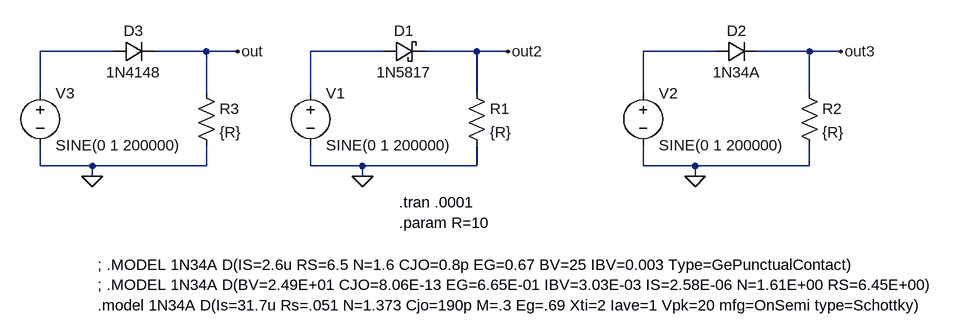
[diagram p0: schematic Diodes-Tests1.asc]
Diodes-Tests1.asc, the LTspice schematic file:
Version 4
SHEET 1 1184 680
WIRE -320 96 -432 96
WIRE -176 96 -256 96
WIRE -128 96 -176 96
WIRE 96 96 -16 96
WIRE 240 96 160 96
WIRE 288 96 240 96
WIRE 608 96 496 96
WIRE 752 96 672 96
WIRE 800 96 752 96
WIRE -432 160 -432 96
WIRE -176 160 -176 96
WIRE -16 160 -16 96
WIRE 240 160 240 96
WIRE 496 160 496 96
WIRE 752 160 752 96
WIRE -432 272 -432 240
WIRE -352 272 -432 272
WIRE -176 272 -176 240
WIRE -176 272 -352 272
WIRE -16 272 -16 240
WIRE 64 272 -16 272
WIRE 240 272 240 240
WIRE 240 272 64 272
WIRE 496 272 496 240
WIRE 576 272 496 272
WIRE 752 272 752 240
WIRE 752 272 576 272
WIRE -352 288 -352 272
WIRE 64 288 64 272
WIRE 576 288 576 272
FLAG 64 288 0
FLAG 288 96 out2
FLAG 576 288 0
FLAG 800 96 out3
FLAG -352 288 0
FLAG -128 96 out
SYMBOL voltage -16 144 R0
WINDOW 123 0 0 Left 0
WINDOW 39 0 0 Left 0
SYMATTR InstName V1
SYMATTR Value SINE(0 1 200000)
SYMBOL schottky 96 112 R270
WINDOW 0 32 32 VTop 2
WINDOW 3 0 32 VBottom 2
SYMATTR InstName D1
SYMATTR Value 1N5817
SYMATTR Description Diode
SYMATTR Type diode
SYMBOL res 224 144 R0
SYMATTR InstName R1
SYMATTR Value {R}
SYMBOL voltage 496 144 R0
WINDOW 123 0 0 Left 0
WINDOW 39 0 0 Left 0
SYMATTR InstName V2
SYMATTR Value SINE(0 1 200000)
SYMBOL res 736 144 R0
SYMATTR InstName R2
SYMATTR Value {R}
SYMBOL voltage -432 144 R0
WINDOW 123 0 0 Left 0
WINDOW 39 0 0 Left 0
SYMATTR InstName V3
SYMATTR Value SINE(0 1 200000)
SYMBOL diode -320 112 R270
WINDOW 0 32 32 VTop 2
WINDOW 3 0 32 VBottom 2
SYMATTR InstName D3
SYMATTR Value 1N4148
SYMBOL res -192 144 R0
SYMATTR InstName R3
SYMATTR Value {R}
SYMBOL diode 608 112 R270
WINDOW 0 32 32 VTop 2
WINDOW 3 0 32 VBottom 2
SYMATTR InstName D2
SYMATTR Value 1N34A
SYMATTR SpiceModel 1N34A
TEXT 120 328 Left 2 !.tran .0001\n.param R=10
TEXT -344 424 Left 2 !; .MODEL 1N34A D(IS=2.6u RS=6.5 N=1.6 CJO=0.8p EG=0.67 BV=25 IBV=0.003 Type=GePunctualContact)\n; .MODEL 1N34A D(BV=2.49E+01 CJO=8.06E-13 EG=6.65E-01 IBV=3.03E-03 IS=2.58E-06 N=1.61E+00 RS=6.45E+00)\n.model 1N34A D(Is=31.7u Rs=.051 N=1.373 Cjo=190p M=.3 Eg=.69 Xti=2 Iave=1 Vpk=20 mfg=OnSemi type=Schottky)

The netlist it stands for:
* Diodes-Tests1.asc
V1 N002 0 SINE(0 1 200000)
D1 N002 out2 1N5817
R1 out2 0 {R}
V2 N003 0 SINE(0 1 200000)
R2 out3 0 {R}
V3 N001 0 SINE(0 1 200000)
D3 N001 out 1N4148
R3 out 0 {R}
D2 N003 out3 1N34A 1N34A
.model D D
.lib standard.dio
.tran .0001
.param R=10
; .MODEL 1N34A D(IS=2.6u RS=6.5 N=1.6 CJO=0.8p EG=0.67 BV=25 IBV=0.003 Type=GePunctualContact)
; .MODEL 1N34A D(BV=2.49E+01 CJO=8.06E-13 EG=6.65E-01 IBV=3.03E-03 IS=2.58E-06 N=1.61E+00 RS=6.45E+00)
.model 1N34A D(Is=31.7u Rs=.051 N=1.373 Cjo=190p M=.3 Eg=.69 Xti=2 Iave=1 Vpk=20 mfg=OnSemi type=Schottky)
.backanno
.end